# EAGLE design sony_display_powersupply (EAGLE 9.1.3)
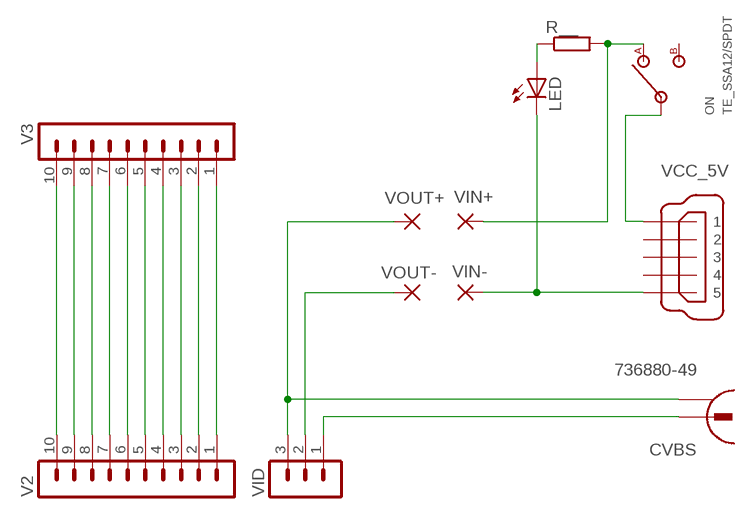
[diagram p0: schematic, sheet 1]

## Parts
CVBS  736880-49  [736880-49]
LED  LED3MM  [LED3MM]
ON  TE_SSA12/SPDT  [TE_SSA12/SPDT]
R__  R-EU_M0805  [M0805]
V2  MA10-1  [MA10-1]
V3  MA10-1  [MA10-1]
VCC_5V  MINI-USB-32005-301  [32005-301]
VID  MA03-1  [MA03-1]
VIN+  2,54/1,0  [2,54/1,0]
VIN-  2,54/1,0  [2,54/1,0]
VOUT+  2,54/1,0  [2,54/1,0]
VOUT-  2,54/1,0  [2,54/1,0]

## Nets
N$1: V2.10 V3.10
N$2: V2.9 V3.9
N$3: V2.8 V3.8
N$4: V2.7 V3.7
N$5: V2.1 V3.1
N$6: V2.2 V3.2
N$7: V2.3 V3.3
N$8: V2.5 V3.5
N$9: V2.4 V3.4
N$10: V2.6 V3.6
N$11: ON.IN VCC_5V.1
N$12: LED.K(C) VCC_5V.5 VIN-.1(P)
N$13: VID.2 VOUT-.1(P)
N$14: CVBS.1 VID.1
N$15: CVBS.2 VID.3 VOUT+.1(P)
N$17: ON.1(A) R__.2 VIN+.1(P)
N$18: LED.A R__.1
Unconnected: CVBS.2@2 ON.2(B) VCC_5V.2 VCC_5V.3 VCC_5V.4

## Library data of the parts
CVBS = con-conrad_mod:736880-49: Cinch Connector ( RCA Jack )
LED = led:LED: LED OSRAM: - CHIPLED LG R971, LG N971, LY N971, LG Q971, LY Q971, LO R971, LY R971 LH N974, LH R974 LS Q976, LO Q976, LY Q976 LO Q996 - Hyper CHIPLED LW Q18S LB Q993, LB Q99A, LB R99A - SideLED LS A670, LO A670, LY A670, LG A670, LP A670 LB A673, LV A673, LT A673, LW A673 LH A674 LY A675 LS A676, LA A676, LO A676, LY A676, LW A676 LS A679, LY A679, LG A679 - Hyper Micro SIDELED® LS Y876, LA Y876, LO Y876, LY Y876 LT Y87S - SmartLED LW L88C, LW L88S LB L89C, LB L89S, LG L890 LS L89K, LO L89K, LY L89K LS L896, LA L896, LO L896, LY L896 - TOPLED LS T670, LO T670, LY T670, LG T670, LP T670 LSG T670, LSP T670, LSY T670, LOP T670, LYG T670 LG T671, LOG T671, LSG T671 LB T673, LV T673, LT T673, LW T673 LH T674 LS T676, LA T676, LO T676, LY T676, LB T676, LH T676, LSB T676, LW T676 LB T67C, LV T67C, LT T67C, LS T67K, LO T67K, LY T67K, LW E67C LS E67B, LA E67B, LO E67B, LY E67B, LB E67C, LV E67C, LT E67C LW T67C LS T679, LY T679, LG T679 LS T770, LO T770, LY T770, LG T770, LP T770 LB T773, LV T773, LT T773, LW T773 LH T774 LS E675, LA E675, LY E675, LS T675 LS T776, LA T776, LO T776, LY T776, LB T776 LHGB T686 LT T68C, LB T68C - Hyper Mini TOPLED® LB M676 - Mini TOPLED Santana® LG M470 LS M47K, LO M47K, LY M47K Source: http://www.osram.convergy.de LUXEON: - LUMILED® LXK2-PW12-R00, LXK2-PW12-S00, LXK2-PW14-U00, LXK2-PW14-V00 LXK2-PM12-R00, LXK2-PM12-S00, LXK2-PM14-U00 LXK2-PE12-Q00, LXK2-PE12-R00, LXK2-PE12-S00, LXK2-PE14-T00, LXK2-PE14-U00 LXK2-PB12-K00, LXK2-PB12-L00, LXK2-PB12-M00, LXK2-PB14-N00, LXK2-PB14-P00, LXK2-PB14-Q00 LXK2-PR12-L00, LXK2-PR12-M00, LXK2-PR14-Q00, LXK2-PR14-R00 LXK2-PD12-Q00, LXK2-PD12-R00, LXK2-PD12-S00 LXK2-PH12-R00, LXK2-PH12-S00 LXK2-PL12-P00, LXK2-PL12-Q00, LXK2-PL12-R00 Source: www.luxeon.com KINGBRIGHT: KA-3528ASYC Source: www.kingbright.com
ON = switches_mod:TE_SSA12/SPDT: SWITCH SLIDE SPDT 2POS SSA SER; DIGIKEY: 450-1602-ND
R__ = rcl:R-EU_: RESISTOR, European symbol; SPICEPREFIX: R
V2 V3 = con-lstb:MA10-1: PIN HEADER; OC_FARNELL: unknown; OC_NEWARK: unknown
VCC_5V = con-cypressindustries:MINI-USB-: MINI USB-B Conector Source: www.cypressindustries.com; OC_FARNELL: unknown; OC_NEWARK: unknown
VID = con-lstb:MA03-1: PIN HEADER; OC_FARNELL: unknown; OC_NEWARK: unknown
VIN+ VIN- VOUT+ VOUT- = wirepad:2,54/1,0: THROUGH-HOLE PAD

## Net classes
0 default: width 0.305 mm, drill 0.305 mm, clearance 0.305 mm
1 disabled: width 0.305 mm, drill 0.305 mm, clearance 0.305 mm to class 0, clearance 0.305 mm

## Board
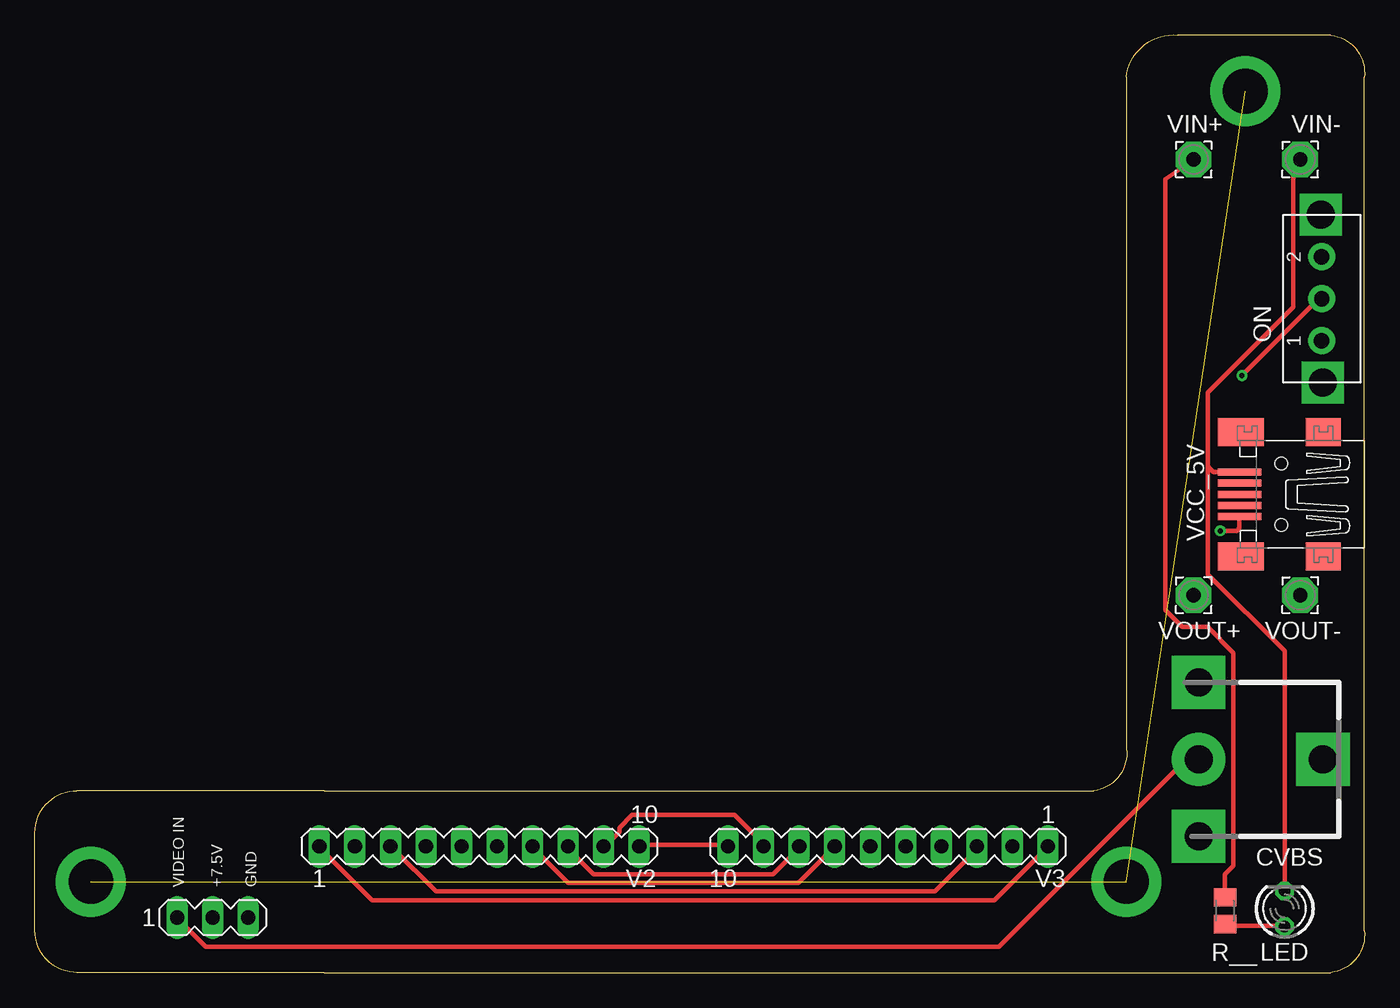
[diagram p1: board, top side]
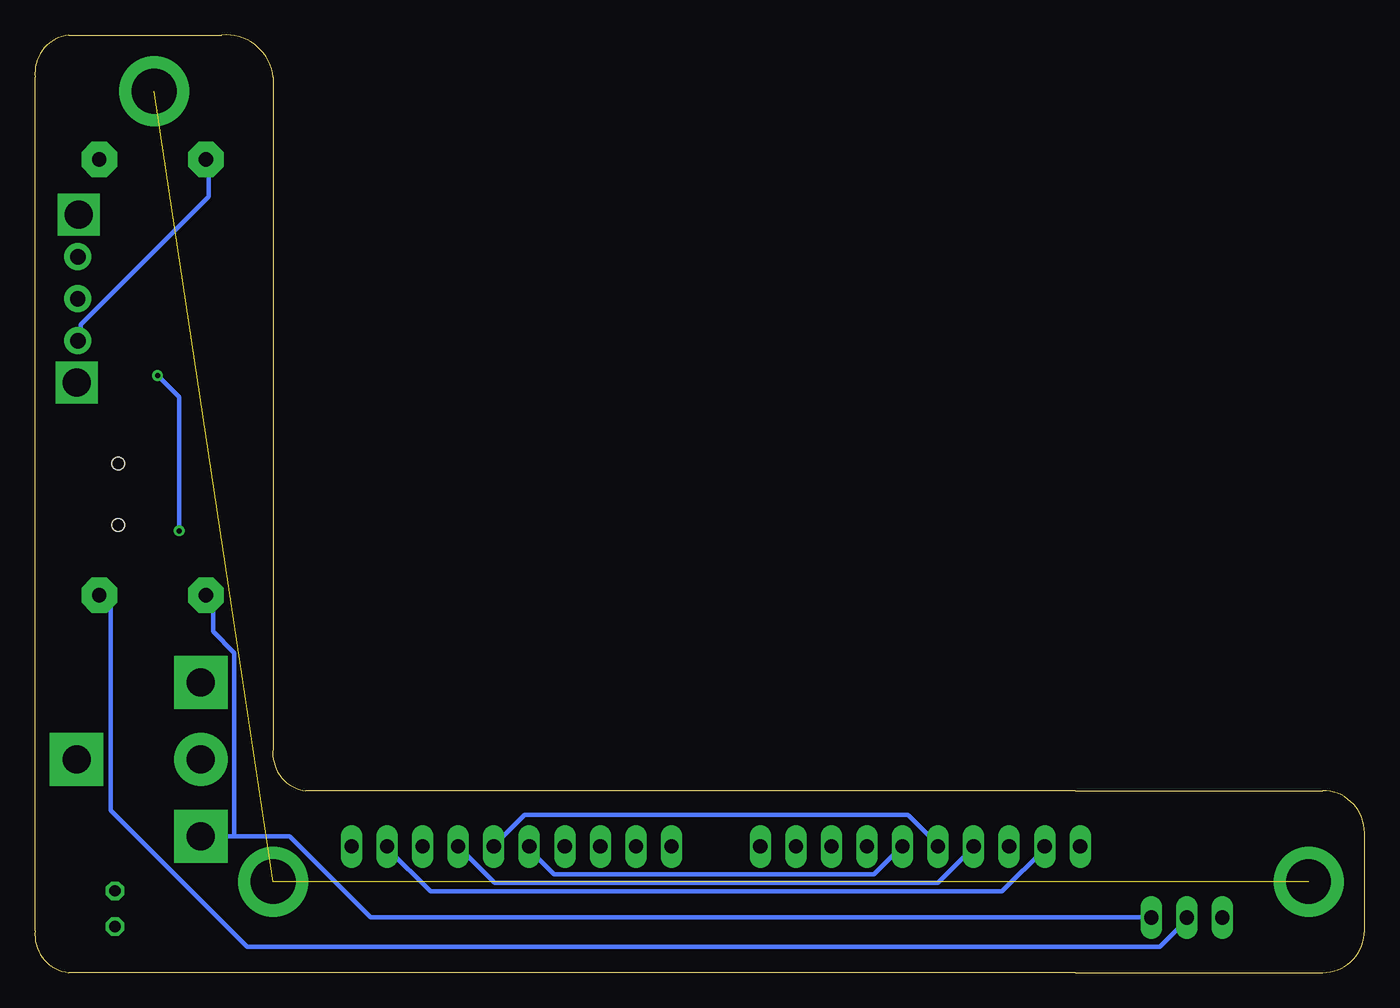
[diagram p2: board, bottom side, seen from below]

Size 95.02 x 67.02 mm. Coordinates in mm from the lower left corner, seen from the top.
Outline: 95,3 95,64 arc90 92.62,67 81.66,67 arc90 78,64 78,16 arc-90 75.66,13 20.66,13 3,13 arc90 0,10 0,3 arc90 3,0 20.66,0 92.62,0 arc90 95,3
Copper layers (1*16): Top 0.035mm / dielectric 1.5mm / Bottom 0.035mm
Design rules "default": minimum track width 6mil, minimum drill 0.35mm, track to track 6mil, track to pad 6mil, pad to pad 6mil, via to via 6mil, smd to smd 6mil, copper to edge 40mil, drill to drill 6mil, minimum pad ring 10mil, minimum via ring 8mil, stop-mask expansion 4mil, vias tented up to drill 0mil, thermal gap 10mil

### Footprints (pad centres in the part's own frame; a part is rotated, then mirrored left to right if it is on the bottom)
736880-49 = drill 2 pad 3.81: 1 5.08,0 | drill 2 pad 3.81 square: 2 5.08,5.5; 2@2 5.08,-5.5; P$1 -3.81,0
LED3MM = drill 0.813 octagon: A -1.27,0; K 1.27,0
TE_SSA12/SPDT = drill 1.092 pad 1.93: 1 -3,1.016; 2 3,1.016; IN 0,1 | drill 2 square: P$1 -6,0.914; P$2 6,1.067
M0805 = smd 1.3 x 1.6: 1 -0.95,0; 2 0.95,0
MA10-1 = drill 1.016 long: 1 -11.43,0; 2 -8.89,0; 3 -6.35,0; 4 -3.81,0; 5 -1.27,0; 6 1.27,0; 7 3.81,0; 8 6.35,0; 9 8.89,0; 10 11.43,0
32005-301 = smd 3.1 x 0.5: 1 3,1.6; 2 3,0.8; 3 3,0; 4 3,-0.8; 5 3,-1.6 | smd 2.5 x 2: M1 -3,-4.45; M2 -3,4.45 | smd 3.3 x 2: M3 2.9,4.45; M4 2.9,-4.45 | hole 0.9: 0,2.2; 0,-2.2
MA03-1 = drill 1.016 long: 1 -2.54,0; 2 0,0; 3 2.54,0
2,54/1,0 = drill 1.016 pad 2.54 octagon: 1 0,0

### Placement (x,y rotation side)
CVBS  88.24,15.24 180 top
LED  89.31,4.57 90 top
ON  92.96,48.16 90 top
R__  85.04,4.42 90 top
V2  31.75,9.02 0 top
V3  60.96,9.02 180 top
VCC_5V  89.08,34.18 180 top
VID  12.7,3.94 0 top
VIN+  82.8,58.12 0 top
VIN-  90.42,58.12 0 top
VOUT+  82.8,26.97 0 top
VOUT-  90.42,26.97 0 top

### Tracks (layer width: path | path; a pad name or v marks a point on that pad's centre or on a via)
N$1
  Top 0.305: V2.10 43.28,9.14 49.38,9.14 V3.10
N$2
  Top 0.305: V2.9 40.84,9.14 41.76,10.06 41.76,10.36 42.67,11.28 49.99,11.28 52.12,9.14 V3.9
N$3
  Top 0.305: V2.8 38.1,8.84 39.93,7.01 52.73,7.01 54.56,8.84 V3.8
N$4
  Top 0.305: V2.7 35.66,8.84 38.1,6.4 54.56,6.4 57,8.84 V3.7
N$5
  Top 0.305: V2.1 20.42,8.84 24.08,5.18 68.58,5.18 72.24,8.84 V3.1
N$6
  Bottom 0.305: V2.2 22.86,8.84 25.91,5.79 66.75,5.79 69.8,8.84 V3.2
N$7
  Top 0.305: V2.3 25.6,8.84 28.65,5.79 64.31,5.79 67.36,8.84 V3.3
N$8
  Bottom 0.305: V2.5 30.48,9.14 32.61,11.28 60.05,11.28 62.18,9.14 V3.5
N$9
  Bottom 0.305: V2.4 28.04,8.84 30.48,6.4 62.18,6.4 64.62,8.84 V3.4
N$10
  Bottom 0.305: V2.6 33.22,8.84 35.05,7.01 57.91,7.01 59.74,8.84 V3.6
N$11  (via drill 0.35)
  Top 0.305: v84.71,31.57 85.88,31.57 86.08,31.77 VCC_5V.1 | v86.26,42.67 91.75,48.16 ON.IN
  Bottom 0.305: v84.71,31.57 84.71,41.12 v86.26,42.67
N$12
  Top 0.305: LED.K 89.31,22.99 83.82,28.47 83.82,36.14 83.83,36.16 | VCC_5V.5 86.07,35.76 84.23,35.76 83.83,36.16 | VIN-.1 89.92,57.91 89.92,47.55 83.82,41.45 83.82,36.2 83.87,36.2 83.84,36.17 83.83,36.16
N$13
  Bottom 0.305: VID.2 12.8,3.66 14.63,1.83 79.86,1.83 89.61,11.58 89.61,26.21 89.86,26.47 VOUT-.1
N$14
  Top 0.305: CVBS.1 82.3,15.24 68.89,1.83 12.19,1.83 10.36,3.66 VID.1
N$15
  Bottom 0.305: 80.77,9.75 82.91,9.75 CVBS.2 | 80.77,9.75 76.81,9.75 71.02,3.96 15.24,3.96 VID.3 | 80.77,9.75 80.77,22.86 82.3,24.38 82.3,26.82 VOUT+.1
N$16  (via drill 3.2 pad 5)  (2 unrouted)
  other vias: 86.5,63 4,6.5 78,6.5
N$17
  Top 0.305: R__.2 85.04,7.01 85.65,7.62 85.65,22.86 83.82,24.69 81.99,24.69 80.77,25.91 80.77,56.69 VIN+.1
  Bottom 0.305: ON.1 91.75,45.41 91.75,46.33 82.6,55.47 82.6,57.91 VIN+.1
N$18
  Top 0.305: R__.1 85.04,3.35 89.31,3.35 LED.A

### Text on the board
tNames: VIDEO IN | +7.5V | GND